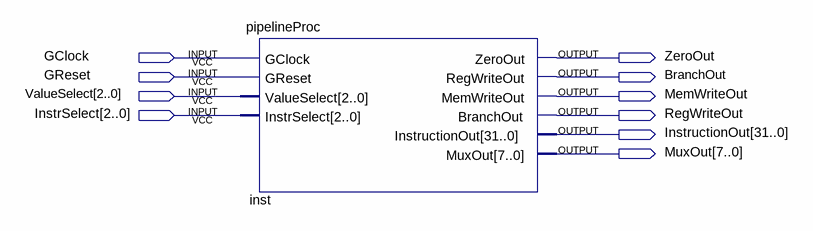
[diagram p0: schematic sheet]
// Quartus schematic topLevel.bdf as structural Verilog: 1 symbols, 10 pins
module topLevel (
  input  GClock,
  input  GReset,
  input  [2:0] ValueSelect,
  input  [2:0] InstrSelect,
  output ZeroOut,
  output BranchOut,
  output MemWriteOut,
  output RegWriteOut,
  output [31:0] InstructionOut,
  output [7:0] MuxOut
);

  pipelineProc inst (
    .GClock(GClock), .GReset(GReset), .ValueSelect(ValueSelect), .InstrSelect(InstrSelect),
    .ZeroOut(ZeroOut), .RegWriteOut(BranchOut), .MemWriteOut(MemWriteOut), .BranchOut(RegWriteOut),
    .InstructionOut(InstructionOut), .MuxOut(MuxOut));
endmodule
